# Altium project VRM_PCB.PrjPcb
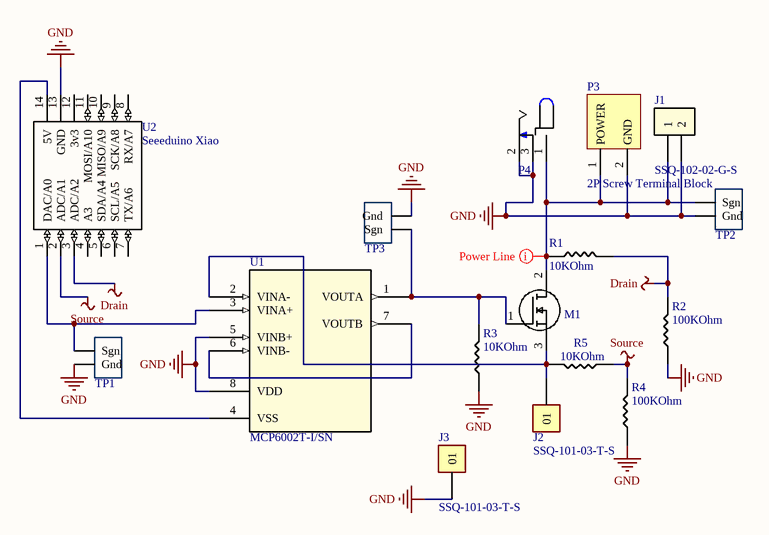
[diagram p0: VRM_Schematic.SchDoc]
1 sheet, 16 parts. Net scope: global (net labels, ports and power ports of the same name join across sheets).
Board file: VRM_BRD.PcbDoc

## Sheet VRM_Schematic.SchDoc
size A; SheetNumber: 1; SheetTotal: 1

### Parts
J1  SSQ-102-02-G-S  [JF-2_1X2_TU_SSQ]
J2  SSQ-101-03-T-S  [JF-1_SSQ-101-03-T-S]
J3  SSQ-101-03-T-S  [JF-1_SSQ-101-03-T-S]
M1  IRL520NPBF  [TO254P469X1042X1967-3P]  (value not drawn)
P3  2P Screw Terminal Block  [P_Terminal block 3.5mm-pitch]
P4  Power Jack  [Power_Jack]  (value not drawn)
R1  value 10KOhm  [1206_Passive_Resitor]  (hidden comment: 10k)
R2  100KOhm  [1206_Passive_Resitor]
R3  value 10KOhm  [1206_Passive_Resitor]  (hidden comment: 10k)
R4  100KOhm  [1206_Passive_Resitor]
R5  value 10KOhm  [1206_Passive_Resitor]  (hidden comment: 10k)
TP1  10x Probe TP  [TP10x_Probe]  (value not drawn)
TP2  10x Probe TP  [TP10x_Probe]  (value not drawn)
TP3  10x Probe TP  [TP10x_Probe]  (value not drawn)
U1  MCP6002T-I/SN  [SOIC127P600X175-8N]
U2  Seeeduino Xiao  [SAMD21_Xiao]

### Nets
Drain: R1.2 R2.2 U2.3(ADC/A2)
GND: J1.2 J3.01 P3.2(GND) P4.2 P4.3 R2.1 R3.1 R4.1 TP1.2(Gnd) TP2.2(Gnd) TP3.2(Gnd) U1.5(VINB+) U1.8(VDD) U2.13(GND)
Source: R4.2 R5.1 U2.2(ADC/A1)
NetJ1_1: J1.1 M1.2(D) P3.1(POWER) P4.1 R1.1 TP2.1(Sgn)
NetJ2_01: J2.01 M1.3(S) R5.2 U1.2(VINA-)
NetM1_1: M1.1(G) R3.2 TP3.1(Sgn) U1.1(VOUTA)
NetTP1_1: TP1.1(Sgn) U1.3(VINA+) U2.1(DAC/A0)
NetU1_4: U1.4(VSS) U2.14(5V)
NetU1_6: U1.6(VINB-) U1.7(VOUTB)

Not connected (* = marked no-connect by the designer): U2 4(A3) 5(SDA/A4) 6(SCL/A5) 7(TX/A6) 8(RX/A7) 9(SCK/A8) 10(MISO/A9) 11(MOSI/A10) 12(3v3)

### Layout directives
rule Width Constraint [Pref Width = 20mil    Min Width = 15mil    Max Width = 100mil]: NetJ1_1

### Library data of the parts
J1 = JF_2_PIN_FEMALE: 2.54mm Straight 1x2P 2 1 Straight,P=2.54mm  Female Headers ROHSon Available; MFR PART #: C49661; MFR PN: SSQ-102-02-G-S; LCSC PART#: C49661
J2 J3 = JF_1_PIN_FEMALE: SSQ Series .100 Tiger Buyâ„¢ Socket Strip, Square Tail; MFR PART #: X6511FV-01-C85D32; MP: SSQ-101-03-T-S; LCSC PART#: C2883837
M1 = Q_Nch_MOSFET_PTH: MOSFET (N-Channel)  IRL520NPBF; Manufacturer_Name: Infineon; Datasheet Link: https://www.infineon.com/dgdl/irl520npbf.pdf?fileId=5546d462533600a40153565f9b62255b; Height: 4.69mm; Manufacturer_Part_Number: IRL520NPBF; Mouser Part Number: 942-IRL520NPBF; Mouser Price/Stock: https://www.mouser.co.uk/ProductDetail/Infineon-IR/IRL520NPBF?qs=9%252BKlkBgLFf3eZ5ppEpIaKQ%3D%3D; Arrow Part Number: IRL520NPBF; Arrow Price/Stock: https://www.arrow.com/en/products/irl520npbf/infineon-technologies-ag?region=nac
P3 = P_Terminal block: Green Straight pin 3.5mm  pitch; P=3.5mm  Screw terminal ROHS; MFR Part #: KF350-3.5-2P; Manufacturer: Cixi Kefa Elec; LCSC Part#: C474892; DataSheet: https://datasheet.lcsc.com/lcsc/2001160007_Cixi-Kefa-Elec-KF350-3-5-2P_C474892.pdf
P4 = P_Power Jack: Power Barrel Connector Jack 2.10mm ID (0.083"), 5.50mm OD (0.217") Through Hole, Right Angle; MFR Part #: PJ-102A; Value: CONN PWR JACK 2X5.5MM SOLDER; Digikey Link: https://www.digikey.com/product-detail/en/PJ-102A/CP-102A-ND/275425/?itemSeq=304982367; LCSC Part#: C136744; Type: Extended
R1 R3 R5 = R_10KOhm_1206: 10 kOhms ±5% 0.25W, 1/4W Chip Resistor 1206 (3216 Metric) Automotive AEC-Q200 Thick Film; MFR Part #: RMCF1206FT10K0; LCSC Part#: C17902; Type: Basic; Digikey Link: https://www.digikey.com/en/products/detail/stackpole-electronics-inc/RMCF1206FT10K0/1759669
R2 R4 = R_100KOhm_1206: 100kΩ ±1% 0.25W ±100ppm/℃ 1206 Chip Resistor - Surface Mount RoHS; MFR Part #: 1206W4F1003T5E; LCSC Part#: C17900; Type: Basic; Value: 100KOhm; Datasheet: https://datasheet.lcsc.com/lcsc/1810301421_UNI-ROYAL-Uniroyal-Elec-1206W4F1003T5E_C17900.pdf
TP1-TP3 = TP_10x_Probe: Test Point 300 mil centers
U1 = U_MCP6002T-I/SN: 0.6 V/us 2 1MHz 1.8V ~ 6V 100μA General Purpose SOIC-8_150mil  Operational Amplifier ROHS; Mfr: Microchip; MFR Part #: MCP6002T-I/SN; DataSheet: https://ww1.microchip.com/downloads/en/DeviceDoc/MCP6001-1R-1U-2-4-1-MHz-Low-Power-Op-Amp-DS20001733L.pdf; LCSC Part#: C7377; Type: Basic
U2 = U_SAMD21_Xiao: Seeeduino XIAO - Arduino Microcontroller - SAMD21 Cortex M0+; Link: https://www.seeedstudio.com/Seeeduino-XIAO-Arduino-Microcontroller-SAMD21-Cortex-M0+-p-4426.html